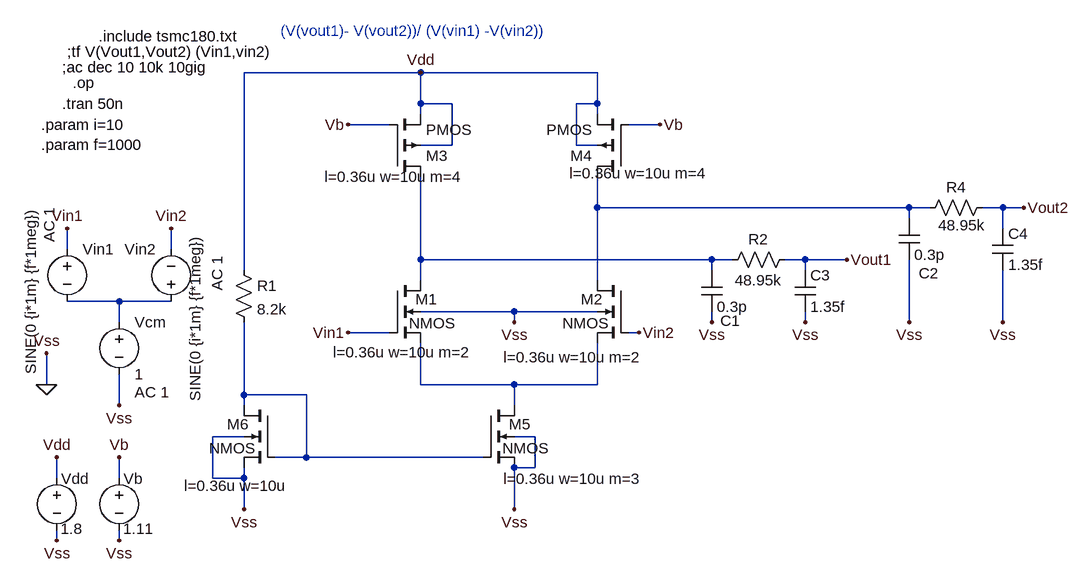
[diagram p0: schematic Delay cell with DP CM_R.asc]
Delay cell with DP CM_R.asc, the LTspice schematic file:
Version 4
SHEET 1 1636 740
WIRE 624 -64 352 -64
WIRE 896 -64 624 -64
WIRE 624 -16 624 -64
WIRE 672 -16 624 -16
WIRE 896 -16 896 -64
WIRE 896 -16 864 -16
WIRE 624 0 624 -16
WIRE 896 0 896 -16
WIRE 576 16 512 16
WIRE 992 16 944 16
WIRE 672 48 672 -16
WIRE 672 48 624 48
WIRE 864 48 864 -16
WIRE 896 48 864 48
WIRE 896 144 896 96
WIRE 1376 144 896 144
WIRE 1408 144 1376 144
WIRE 1520 144 1488 144
WIRE 1552 144 1520 144
WIRE 1376 160 1376 144
WIRE 1520 176 1520 144
WIRE 80 208 80 176
WIRE 240 208 240 176
WIRE 624 224 624 96
WIRE 1072 224 624 224
WIRE 1104 224 1072 224
WIRE 1216 224 1184 224
WIRE 1280 224 1216 224
WIRE 352 240 352 -64
WIRE 1072 240 1072 224
WIRE 1216 240 1216 224
WIRE 624 256 624 224
WIRE 896 256 896 144
WIRE 160 288 80 288
WIRE 240 288 160 288
WIRE 768 304 624 304
WIRE 896 304 768 304
WIRE 160 320 160 288
WIRE 768 320 768 304
WIRE 1072 320 1072 304
WIRE 1216 320 1216 304
WIRE 1376 320 1376 224
WIRE 1520 320 1520 240
WIRE 576 336 512 336
WIRE 960 336 944 336
WIRE 48 416 48 368
WIRE 624 416 624 352
WIRE 768 416 624 416
WIRE 896 416 896 352
WIRE 896 416 768 416
WIRE 352 432 352 320
WIRE 448 432 352 432
WIRE 160 448 160 400
WIRE 352 448 352 432
WIRE 768 448 768 416
WIRE 352 496 304 496
WIRE 800 496 768 496
WIRE 448 528 448 432
WIRE 448 528 400 528
WIRE 720 528 448 528
WIRE 800 544 800 496
WIRE 800 544 768 544
WIRE 64 560 64 528
WIRE 160 560 160 528
WIRE 304 560 304 496
WIRE 352 560 352 544
WIRE 352 560 304 560
WIRE 352 608 352 560
WIRE 768 608 768 544
WIRE 64 656 64 640
WIRE 160 656 160 640
FLAG 48 416 0
FLAG 48 368 Vss
FLAG 64 656 Vss
FLAG 160 448 Vss
FLAG 64 528 Vdd
FLAG 512 336 Vin1
FLAG 624 -64 Vdd
FLAG 960 336 Vin2
FLAG 768 608 Vss
FLAG 768 320 Vss
FLAG 80 176 Vin1
FLAG 240 176 Vin2
FLAG 512 16 Vb
FLAG 992 16 Vb
FLAG 160 656 Vss
FLAG 160 528 Vb
FLAG 1280 224 Vout1
FLAG 1552 144 Vout2
FLAG 1072 320 Vss
FLAG 1376 320 Vss
FLAG 352 608 Vss
FLAG 1520 320 Vss
FLAG 1216 320 Vss
SYMBOL nmos4 576 256 R0
WINDOW 0 40 29 Left 2
WINDOW 3 30 66 Left 2
WINDOW 123 127 110 Right 2
SYMATTR InstName M1
SYMATTR Value2 l=0.36u w=10u m=2
SYMBOL voltage 64 544 R0
WINDOW 123 0 0 Left 0
WINDOW 39 0 0 Left 0
WINDOW 0 7 17 Left 2
WINDOW 3 6 94 Left 2
SYMATTR InstName Vdd
SYMATTR Value 1.8
SYMBOL nmos4 944 256 M0
WINDOW 0 40 29 Left 2
WINDOW 3 30 66 Left 2
WINDOW 123 -21 118 Left 2
SYMATTR InstName M2
SYMATTR Value2 l=0.36u w=10u m=2
SYMBOL voltage 160 304 R0
WINDOW 123 24 124 Left 2
WINDOW 39 0 0 Left 0
SYMATTR Value2 AC 1
SYMATTR InstName Vcm
SYMATTR Value 1
SYMBOL voltage 80 192 R0
WINDOW 3 -56 -48 VRight 2
WINDOW 123 -28 -48 VRight 2
WINDOW 39 0 0 Left 0
SYMATTR Value SINE(0 {i*1m} {f*1meg})
SYMATTR Value2 AC 1
SYMATTR InstName Vin1
SYMBOL voltage 240 304 R180
WINDOW 0 24 96 Left 2
WINDOW 3 -37 -138 VRight 2
WINDOW 123 -71 32 VRight 2
WINDOW 39 0 0 Left 0
SYMATTR InstName Vin2
SYMATTR Value SINE(0 {i*1m} {f*1meg})
SYMATTR Value2 AC 1
SYMBOL pmos4 576 96 M180
WINDOW 123 -100 0 Left 2
SYMATTR Value2 l=0.36u w=10u m=4
SYMATTR InstName M3
SYMBOL pmos4 944 96 R180
WINDOW 123 -123 5 Left 2
SYMATTR Value2 l=0.36u w=10u m=4
SYMATTR InstName M4
SYMBOL voltage 160 544 R0
WINDOW 123 0 0 Left 0
WINDOW 39 0 0 Left 0
WINDOW 0 7 17 Left 2
WINDOW 3 6 94 Left 2
SYMATTR InstName Vb
SYMATTR Value 1.11
SYMBOL cap 1056 240 R0
WINDOW 0 29 78 Left 2
SYMATTR InstName C1
SYMATTR Value 0.3p
SYMBOL cap 1360 160 R0
WINDOW 0 31 85 Left 2
SYMATTR InstName C2
SYMATTR Value 0.3p
SYMBOL nmos4 720 448 R0
WINDOW 0 40 29 Left 2
WINDOW 3 30 66 Left 2
WINDOW 123 245 113 Right 2
SYMATTR InstName M5
SYMATTR Value2 l=0.36u w=10u m=3
SYMBOL nmos4 400 448 M0
WINDOW 0 40 29 Left 2
WINDOW 3 30 66 Left 2
WINDOW 123 140 124 Right 2
SYMATTR InstName M6
SYMATTR Value2 l=0.36u w=10u
SYMBOL res 336 224 R0
SYMATTR InstName R1
SYMATTR Value 8.2k
SYMBOL cap 1200 240 R0
SYMATTR InstName C3
SYMATTR Value 1.35f
SYMBOL cap 1504 176 R0
SYMATTR InstName C4
SYMATTR Value 1.35f
SYMBOL res 1200 208 R90
WINDOW 0 0 56 VBottom 2
WINDOW 3 32 56 VTop 2
SYMATTR InstName R2
SYMATTR Value 48.95k
SYMBOL res 1504 128 R90
WINDOW 0 0 56 VBottom 2
WINDOW 3 27 47 VTop 2
SYMATTR InstName R4
SYMATTR Value 48.95k
TEXT 128 -120 Left 2 !.include tsmc180.txt
TEXT 88 -48 Left 2 !.op
TEXT 80 -96 Left 2 !;tf V(Vout1,Vout2) (Vin1,vin2)
TEXT 72 -72 Left 2 !;ac dec 10 10k 10gig
TEXT 72 -16 Left 2 !.tran 50n
TEXT 408 -128 Left 2 ;(V(vout1)- V(vout2))/ (V(vin1) -V(vin2))
TEXT 40 16 Left 2 !.param i=10\n.param f=1000

The netlist it stands for:
* Delay cell with DP CM_R.asc
M1 N002 Vin1 N004 0 NMOS l=0.36u w=10u m=2
Vdd Vdd 0 1.8
M2 N001 Vin2 N004 0 NMOS l=0.36u w=10u m=2
Vcm N003 0 1 AC 1
Vin1 Vin1 N003 SINE(0 {i*1m} {f*1meg}) AC 1
Vin2 N003 Vin2 SINE(0 {i*1m} {f*1meg}) AC 1
M3 N002 Vb Vdd Vdd PMOS l=0.36u w=10u m=4
M4 N001 Vb Vdd Vdd PMOS l=0.36u w=10u m=4
Vb Vb 0 1.11
C1 N002 0 0.3p
C2 N001 0 0.3p
M5 N004 N005 0 0 NMOS l=0.36u w=10u m=3
M6 N005 N005 0 0 NMOS l=0.36u w=10u
R1 Vdd N005 8.2k
C3 Vout1 0 1.35f
C4 Vout2 0 1.35f
R2 Vout1 N002 48.95k
R4 Vout2 N001 48.95k
.model NMOS NMOS
.model PMOS PMOS
.lib standard.mos
.include tsmc180.txt
.op
;tf V(Vout1,Vout2) (Vin1,vin2)
;ac dec 10 10k 10gig
.tran 50n
* (V(vout1)- V(vout2))/ (V(vin1) -V(vin2))
.param i=10
.param f=1000
.backanno
.end